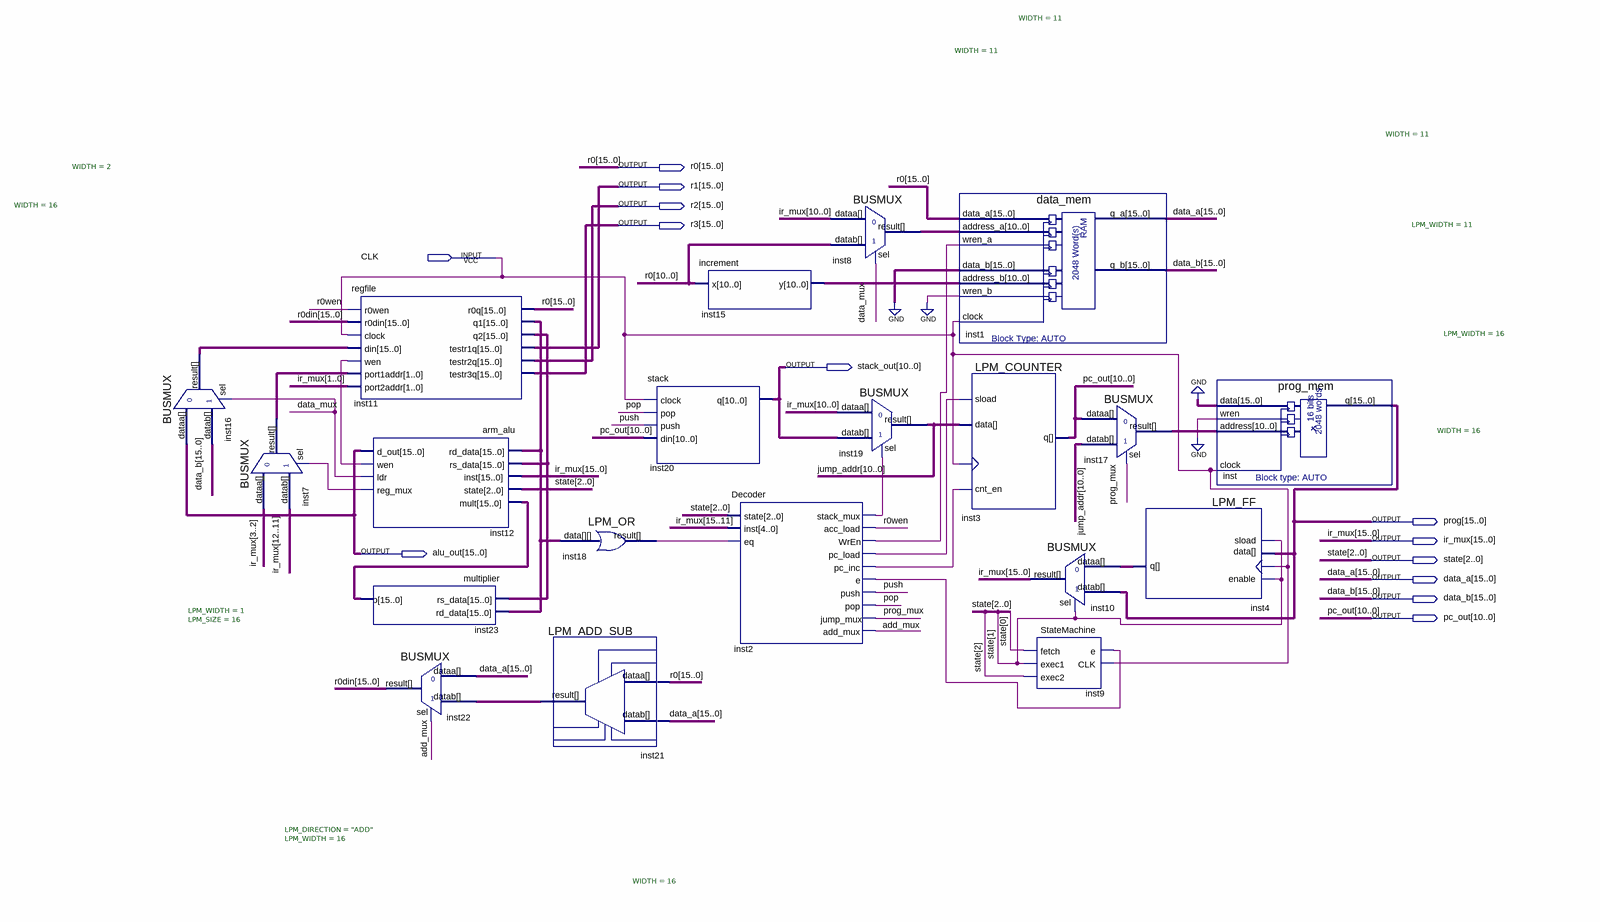
[diagram p0: schematic sheet]
// Quartus schematic HarvardArch.bdf as structural Verilog: 20 symbols, 13 pins
module HarvardArch (
  input  CLK,
  output [15:0] r0,
  output [15:0] r1,
  output [15:0] r2,
  output [15:0] r3,
  output [10:0] stack_out,
  output [15:0] prog,
  output [15:0] ir_mux,
  output [15:0] alu_out,
  output [2:0] state,
  output [15:0] data_a,
  output [15:0] data_b,
  output [10:0] pc_out
);

  wire add_mux, data_mux, inst2_e, inst2_pc_inc, inst2_pc_load, inst2_stack_mux, inst2_wren, inst12_reg_mux,
       inst12_wen, inst18_result, pop, prog_mux, push, r0wen;
  wire [1:0] inst7_result;
  wire [10:0] inst8_result, inst15_y, inst17_result, jump_addr;
  wire [15:0] inst4_q, inst11_q1, inst11_q2, inst16_result, inst21_result, inst23_p, r0din;

  BUSMUX #(.WIDTH(16)) inst16 (.datab(data_b), .sel(data_mux), .dataa(alu_out), .result(inst16_result));
  BUSMUX #(.WIDTH(2)) inst7 (.datab(ir_mux[12:11]), .sel(inst12_reg_mux), .dataa(ir_mux[3:2]), .result(inst7_result));
  regfile inst11 (
    .r0wen(r0wen), .r0din(r0din), .clock(CLK), .din(inst16_result), .wen(inst12_wen),
    .port1addr(inst7_result), .port2addr(ir_mux[1:0]), .r0q(r0), .q1(inst11_q1), .q2(inst11_q2),
    .testr1q(r1), .testr2q(r2), .testr3q(r3));
  arm_alu inst12 (
    .rd_data(inst11_q1), .rs_data(inst11_q2), .inst(ir_mux), .state(state), .mult(inst23_p), .d_out(alu_out),
    .wen(inst12_wen), .ldr(data_mux), .reg_mux(inst12_reg_mux));
  multiplier inst23 (.rs_data(inst11_q2), .rd_data(inst11_q1), .p(inst23_p));
  BUSMUX #(.WIDTH(16)) inst22 (.datab(inst21_result), .sel(add_mux), .dataa(data_a), .result(r0din));
  LPM_OR #(.LPM_WIDTH(1), .LPM_SIZE(16)) inst18 (.data(inst11_q1), .result(inst18_result));
  LPM_ADD_SUB #(.LPM_DIRECTION("ADD"), .LPM_WIDTH(16)) inst21 (.dataa(r0), .datab(data_a), .result(inst21_result));
  stack inst20 (.clock(CLK), .pop(pop), .push(push), .din(pc_out), .q(stack_out));
  increment inst15 (.x(r0[10:0]), .y(inst15_y));
  Decoder inst2 (
    .state(state), .inst(ir_mux[15:11]), .eq(inst18_result), .stack_mux(inst2_stack_mux), .acc_load(r0wen),
    .WrEn(inst2_wren), .pc_load(inst2_pc_load), .pc_inc(inst2_pc_inc), .e(inst2_e), .push(push), .pop(pop),
    .jump_mux(prog_mux), .add_mux(add_mux));
  BUSMUX #(.WIDTH(11)) inst8 (.datab(r0[10:0]), .sel(data_mux), .dataa(ir_mux[10:0]), .result(inst8_result));
  BUSMUX #(.WIDTH(11)) inst19 (.datab(stack_out), .sel(inst2_stack_mux), .dataa(ir_mux[10:0]), .result(jump_addr));
  data_mem inst1 (
    .data_a(r0), .address_a(inst8_result), .wren_a(inst2_wren), .data_b({16{1'b0}}), .address_b(inst15_y),
    .wren_b(1'b0), .clock(CLK), .q_a(data_a), .q_b(data_b));
  LPM_COUNTER #(.LPM_WIDTH(11)) inst3 (
    .sload(inst2_pc_load), .data(jump_addr), .clock(CLK), .cnt_en(inst2_pc_inc), .q(pc_out));
  BUSMUX #(.WIDTH(16)) inst10 (.datab(prog), .sel(state[1]), .dataa(inst4_q), .result(ir_mux));
  StateMachine inst9 (.e(inst2_e), .CLK(CLK), .fetch(state[0]), .exec1(state[1]), .exec2(state[2]));
  BUSMUX #(.WIDTH(11)) inst17 (.datab(jump_addr), .sel(prog_mux), .dataa(pc_out), .result(inst17_result));
  LPM_FF #(.LPM_WIDTH(16)) inst4 (.enable(state[1]), .clock(CLK), .sload(state[1]), .data(prog), .q(inst4_q));
  prog_mem inst (.data({16{1'b0}}), .wren(1'b0), .address(inst17_result), .clock(CLK), .q(prog));
endmodule
